# EAGLE design MainBoard (EAGLE 7.6.0)
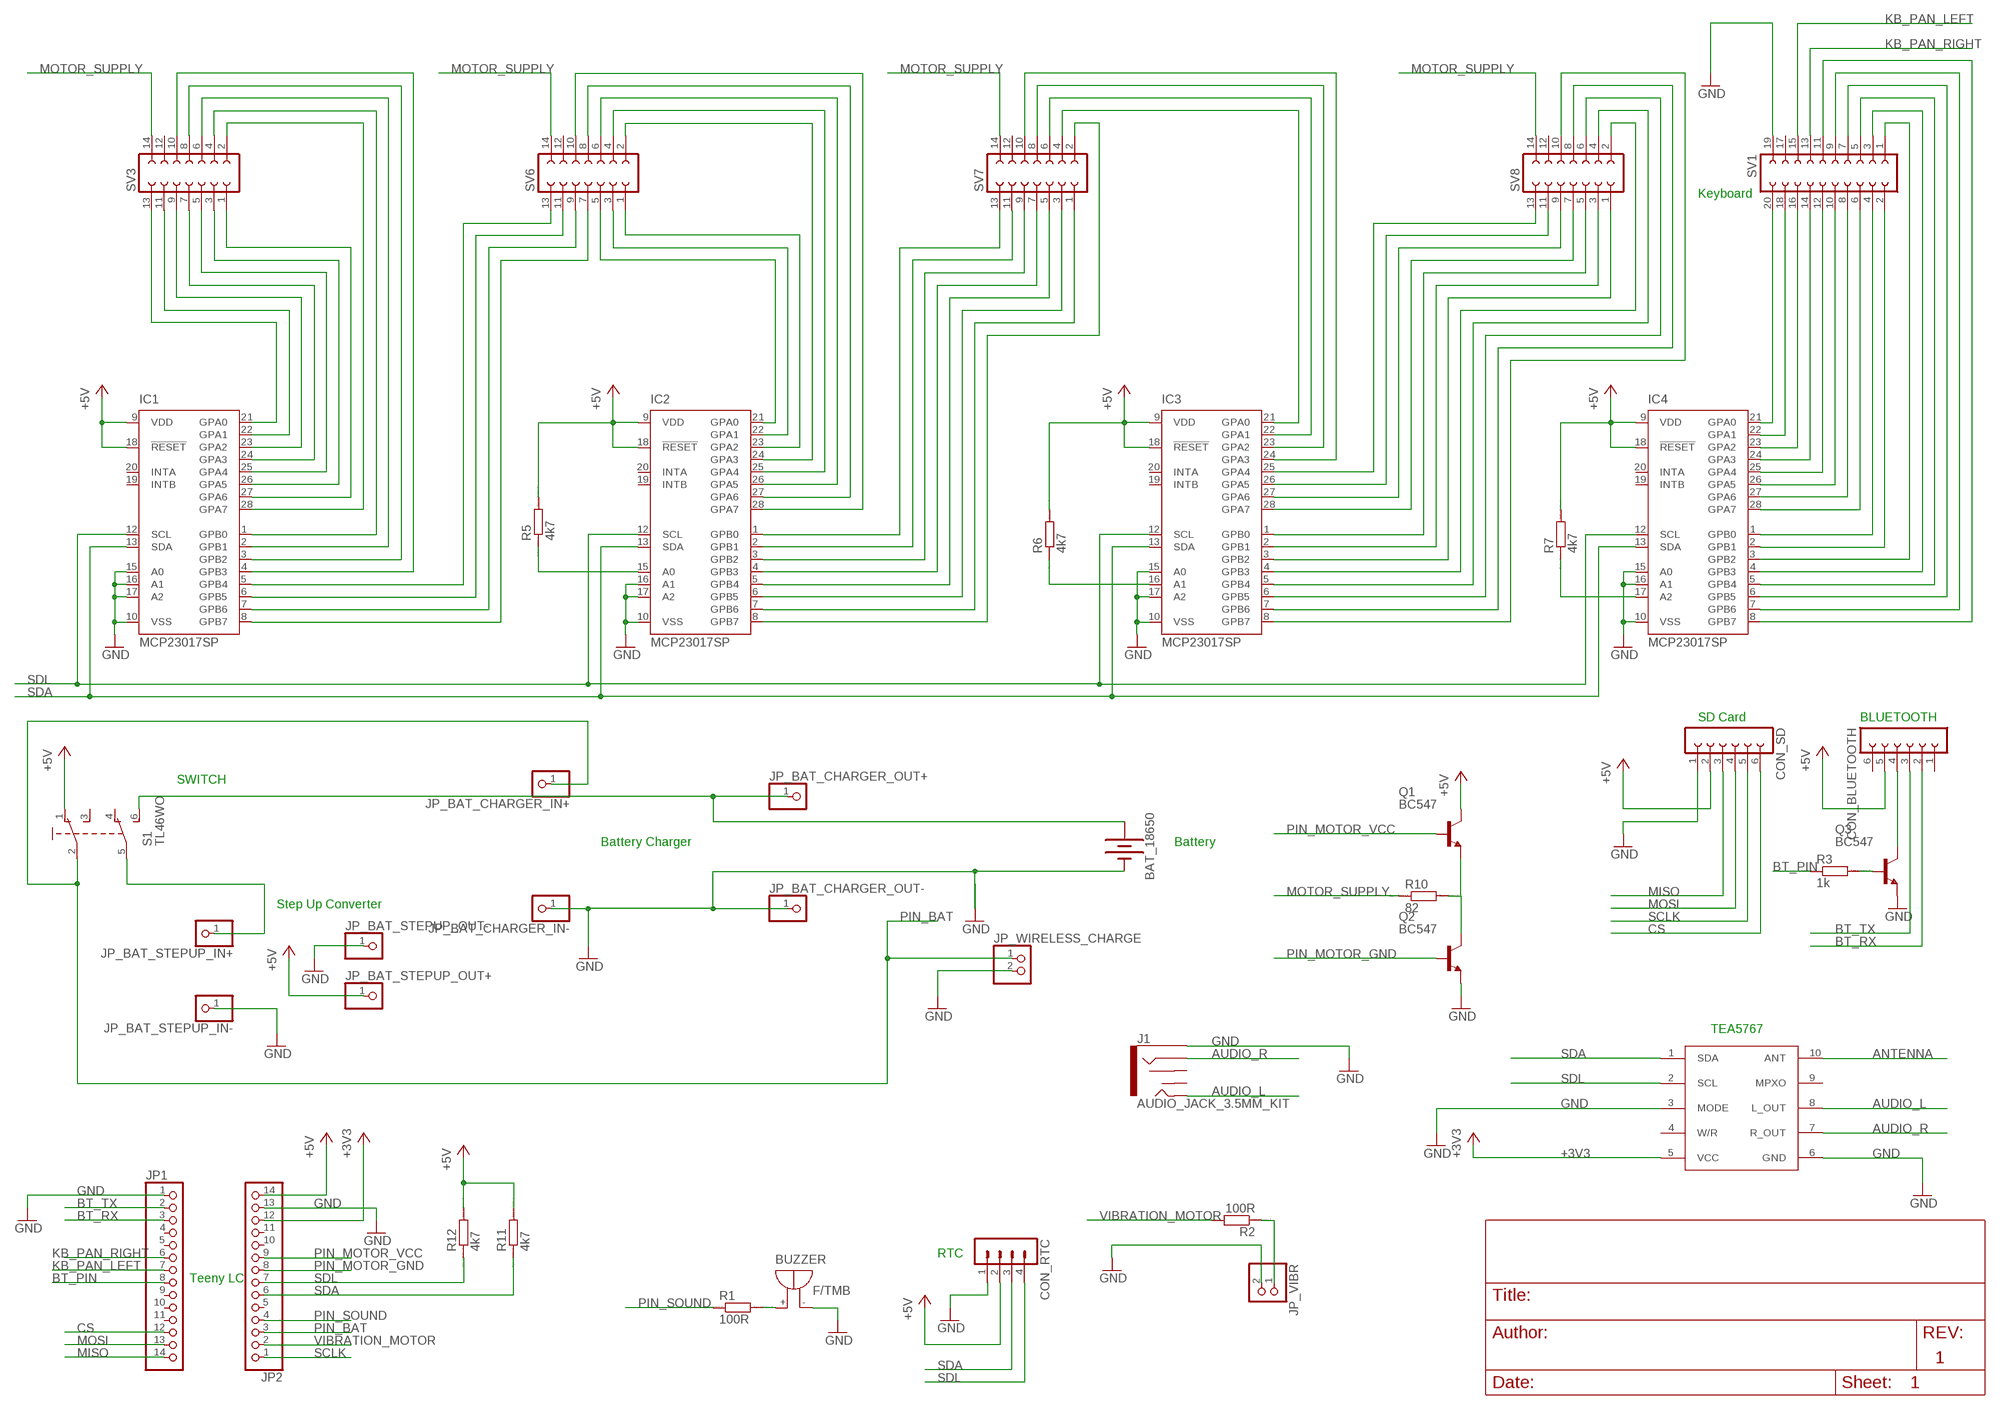
[diagram p0: schematic, sheet 1]
FRAME1 (DINA4_L): AUTHOR: Christoph Ulbinger, BSc; TITLE: Mainboard

## Parts
BAT_18650  BATTERY-18650  [BATTERY_18650-HOLDER]
BUZZER  F/TMB  [F/TMB]
CON_BLUETOOTH  FE06-1  [FE06]
CON_RTC  MA04-1  [MA04-1]
CON_SD  FE06-1  [FE06]
IC1  MCP23017SP  [DIL28-3]
IC2  MCP23017SP  [DIL28-3]
IC3  MCP23017SP  [DIL28-3]
IC4  MCP23017SP  [DIL28-3]
J1  AUDIO_JACK_3.5MM_KIT  [AUDIO-JACK-KIT]
JP1  PINHD-1X14  [1X14]
JP2  PINHD-1X14  [1X14]
JP_BAT_CHARGER_IN+  PINHD-1X1  [1X01]
JP_BAT_CHARGER_IN-  PINHD-1X1  [1X01]
JP_BAT_CHARGER_OUT+  PINHD-1X1  [1X01]
JP_BAT_CHARGER_OUT-  PINHD-1X1  [1X01]
JP_BAT_STEPUP_IN+  PINHD-1X1  [1X01]
JP_BAT_STEPUP_IN-  PINHD-1X1  [1X01]
JP_BAT_STEPUP_OUT+  PINHD-1X1  [1X01]
JP_BAT_STEPUP_OUT-  PINHD-1X1  [1X01]
JP_VIBR  PINHD-1X2  [1X02]
JP_WIRELESS_CHARGE  PINHD-1X2  [1X02]
Q1  BC547  [TO92]
Q2  BC547  [TO92]
Q3  BC547  [TO92]
R1  100R  RR1206  [R1206]
R2  100R  RR1206  [R1206]
R3  1k  RR1206  [R1206]
R5  4k7  RR1206  [R1206]
R6  4k7  RR1206  [R1206]
R7  4k7  RR1206  [R1206]
R10  82  RR1206  [R1206]
R11  4k7  RR1206  [R1206]
R12  4k7  RR1206  [R1206]
S1  TL46WO  [TL4XWO]
SV1  FE10-2  [FE10-2]
SV3  FE07-2  [FE07-2]
SV6  FE07-2  [FE07-2]
SV7  FE07-2  [FE07-2]
SV8  FE07-2  [FE07-2]
TEA5767  TEA5767BREAKOUT  [TEA5767MM2]

## Nets
+3V3: JP2.12 TEA5767.5(VCC)
+5V: CON_BLUETOOTH.5 CON_RTC.2 CON_SD.2 IC1.9(VDD) IC1.18(!RESET) IC2.9(VDD) IC2.18(!RESET) IC3.9(VDD) IC3.18(!RESET) IC4.9(VDD) IC4.18(!RESET) JP2.14 JP_BAT_STEPUP_OUT+.1 Q1.3(C) R5.2 R6.2 R7.2 R11.2 R12.2 S1.1(O)
ANTENNA: TEA5767.10(ANT)
AUDIO_L: J1.TIP TEA5767.8(L_OUT)
AUDIO_R: J1.RING TEA5767.7(R_OUT)
BAT_PLUS: BAT_18650.PWR@1(+) JP_BAT_CHARGER_OUT+.1 S1.6(S1)
BT_PIN: JP1.8 R3.1
BT_RX: CON_BLUETOOTH.2 JP1.3
BT_TX: CON_BLUETOOTH.3 JP1.2
CS: CON_SD.6 JP1.12
GND: BAT_18650.GND@1(-) BUZZER.- CON_RTC.1 CON_SD.1 IC1.10(VSS) IC1.15(A0) IC1.16(A1) IC1.17(A2) IC2.10(VSS) IC2.16(A1) IC2.17(A2) IC3.10(VSS) IC3.15(A0) IC3.17(A2) IC4.10(VSS) IC4.15(A0) IC4.16(A1) J1.SLEEVE JP1.1 JP2.13 JP_BAT_CHARGER_IN-.1 JP_BAT_CHARGER_OUT-.1 JP_BAT_STEPUP_IN-.1 JP_BAT_STEPUP_OUT-.1 JP_VIBR.2 JP_WIRELESS_CHARGE.2 Q2.1(E) Q3.1(E) SV1.19 TEA5767.3(MODE) TEA5767.6(GND)
KB_PAN_LEFT: JP1.7 SV1.15
KB_PAN_RIGHT: JP1.6 SV1.13
MISO: CON_SD.3 JP1.14
MOSI: CON_SD.4 JP1.13
MOTOR_SUPPLY: R10.1 SV3.14 SV6.14 SV7.14 SV8.14
N$1: IC4.25(GPA4) SV1.12
N$2: Q1.1(E) Q2.3(C) R10.2
N$3: IC1.5(GPB4) SV6.13
N$4: IC4.26(GPA5) SV1.10
N$5: IC4.27(GPA6) SV1.8
N$6: IC4.28(GPA7) SV1.6
N$7: IC4.1(GPB0) SV1.4
N$8: IC4.24(GPA3) SV1.14
N$9: IC4.23(GPA2) SV1.16
N$10: IC4.22(GPA1) SV1.18
N$11: IC4.21(GPA0) SV1.20
N$12: IC4.2(GPB1) SV1.2
N$13: IC4.3(GPB2) SV1.1
N$14: IC4.4(GPB3) SV1.3
N$15: IC4.5(GPB4) SV1.5
N$16: IC4.6(GPB5) SV1.7
N$17: IC4.7(GPB6) SV1.9
N$18: IC4.8(GPB7) SV1.11
N$19: IC1.6(GPB5) SV6.11
N$21: IC3.4(GPB3) SV8.2
N$22: CON_BLUETOOTH.4 Q3.3(C)
N$23: IC2.2(GPB1) SV7.11
N$25: Q3.2(B) R3.2
N$28: BUZZER.+ R1.2
N$29: JP_VIBR.1 R2.1
N$30: JP_BAT_STEPUP_IN+.1 S1.5(P1)
N$35: IC1.7(GPB6) SV6.9
N$37: IC1.8(GPB7) SV6.7
N$39: IC3.21(GPA0) SV7.4
N$40: IC2.22(GPA1) SV6.3
N$41: IC2.25(GPA4) SV6.4
N$42: IC2.26(GPA5) SV6.6
N$43: IC2.27(GPA6) SV6.8
N$44: IC2.28(GPA7) SV6.10
N$45: IC2.1(GPB0) SV7.13
N$47: IC2.3(GPB2) SV7.9
N$48: IC2.4(GPB3) SV7.7
N$49: IC2.5(GPB4) SV7.5
N$56: IC1.24(GPA3) SV3.7
N$57: IC1.23(GPA2) SV3.9
N$58: IC1.22(GPA1) SV3.11
N$59: IC1.25(GPA4) SV3.5
N$60: IC1.26(GPA5) SV3.3
N$61: IC1.27(GPA6) SV3.1
N$62: IC1.28(GPA7) SV3.2
N$63: IC1.1(GPB0) SV3.4
N$64: IC1.2(GPB1) SV3.6
N$65: IC1.3(GPB2) SV3.8
N$66: IC1.4(GPB3) SV3.10
N$74: IC4.17(A2) R7.1
N$76: IC3.16(A1) R6.1
N$78: IC2.15(A0) R5.1
N$79: IC3.22(GPA1) SV7.6
N$83: IC2.7(GPB6) SV7.1
N$84: IC1.21(GPA0) SV3.13
N$85: IC2.8(GPB7) SV7.2
N$88: IC2.6(GPB5) SV7.3
N$96: IC2.24(GPA3) SV6.2
N$97: IC2.21(GPA0) SV6.5
N$98: IC2.23(GPA2) SV6.1
N$99: IC3.23(GPA2) SV7.8
N$100: IC3.26(GPA5) SV8.11
N$101: IC3.6(GPB5) SV8.6
N$102: IC3.8(GPB7) SV8.10
N$103: IC3.7(GPB6) SV8.8
N$104: IC3.5(GPB4) SV8.4
N$105: IC3.3(GPB2) SV8.1
N$106: IC3.2(GPB1) SV8.3
N$107: IC3.1(GPB0) SV8.5
N$108: IC3.28(GPA7) SV8.7
N$109: IC3.27(GPA6) SV8.9
N$110: IC3.25(GPA4) SV8.13
N$111: IC3.24(GPA3) SV7.10
PIN_BAT: JP2.3 JP_BAT_CHARGER_IN+.1 JP_WIRELESS_CHARGE.1 S1.2(P)
PIN_MOTOR_GND: JP2.8 Q2.2(B)
PIN_MOTOR_VCC: JP2.9 Q1.2(B)
PIN_SOUND: JP2.4 R1.1
SCLK: CON_SD.5 JP2.1
SDA: CON_RTC.3 IC1.13(SDA) IC2.13(SDA) IC3.13(SDA) IC4.13(SDA) JP2.6 R11.1 TEA5767.1(SDA)
SDL: CON_RTC.4 IC1.12(SCL) IC2.12(SCL) IC3.12(SCL) IC4.12(SCL) JP2.7 R12.1 TEA5767.2(SCL)
VIBRATION_MOTOR: JP2.2 R2.2
Unconnected: CON_BLUETOOTH.1 CON_BLUETOOTH.6 IC1.19(INTB) IC1.20(INTA) IC2.19(INTB) IC2.20(INTA) IC3.19(INTB) IC3.20(INTA) IC4.19(INTB) IC4.20(INTA) J1.RSH J1.TSH JP1.4 JP1.5 JP1.9 JP1.10 JP1.11 JP2.5 JP2.10 JP2.11 S1.3(S) S1.4(O1) SV1.17 SV3.12 SV6.12 SV7.12 SV8.12 TEA5767.4(W/R) TEA5767.9(MPXO)

## Notes on the sheet
- Keyboard
- SD Card | BLUETOOTH
- SWITCH
- Battery Charger | Battery
- Step Up Converter
- TEA5767
- RTC
- Teeny LC

## Library data of the parts
BAT_18650 = SparkFun-Batteries:BATTERY: Battery - Single Cell A variety of battery chemistries, sizes, and footprints. Device List: 20MM_PTH - Coin Cell Battery Holder - 20mm (PTH) <https://www.sparkfun.com/products/783> 12MM_SMD - Coin Cell Battery Holder - 12mm (SMD) <https://www.sparkfun.com/products/10592> 12MM_PTH - Coin Cell Battery Holder - 12mm (PTH) <https://www.sparkfun.com/products/7948> 20MM_SMD - 20mm Coin Cell Battery Holder (SMD) (2 legs) Used on the Big Time Watch Kit <https://www.sparkfun.com/products/11734> 20MM_SMD_4LEGS - Coin Cell Battery Holder - 20mm (SMD) <https://www.sparkfun.com/products/11892> 20MM_SMD_4LEGS_OVERPASTE - Coin Cell Battery Holder - 20mm (SMD) <https://www.sparkfun.com/products/11892> (Over-paste on the legs) 24.5MM_PTH - Coin Cell Battery Holder - 24.5mm (PTH) <https://www.sparkfun.com/products/8863> 9V - 9V Battery Holder - PC Mount Used on the SparkFun SparkPunk Sound Kit <https://www.sparkfun.com/products/11177> and SparkFun SparkPunk Sequencer Kit <https://www.sparkfun.com/products/12707> 18650 - Battery Holder - 18650 (PTH) <https://www.sparkfun.com/products/13113> AA - Battery Holder - 1xAA (PTH) <https://www.sparkfun.com/products/7949> AAA - Battery Holder - 1xAAA (PTH) <https://www.sparkfun.com/products/12718> AA_KIT - Battery Holder - 1xAA (PTH) <https://www.sparkfun.com/products/7949> Special kit package - pads only have exposed copper on one side of the board. AAA_KIT - Battery Holder - 1xAAA (PTH) <https://www.sparkfun.com/products/12718> Special kit package - pads only have exposed copper on one side of the board.; PROD_ID: BATT-12327; SF_SKU: PRT-13113
BUZZER = buzzer:F/TMB: BUZZER Source: Buerklin; OC_FARNELL: unknown; OC_NEWARK: unknown
CON_BLUETOOTH CON_SD = con-lsta:FE06-1: FEMALE HEADER; OC_FARNELL: unknown; OC_NEWARK: unknown
CON_RTC = con-lstb:MA04-1: PIN HEADER; OC_FARNELL: unknown; OC_NEWARK: unknown
IC1-IC4 = microchip:MCP23017: http://ww1.microchip.com/downloads/en/DeviceDoc/21952a.pdf Source: http://ww1.microchip.com/downloads/en/DeviceDoc/21952a.pdf; MF: MICROCHIP; MPN: MCP23017-E/SP; OC_FARNELL: 1332088; OC_NEWARK: 31K2959
J1 = SparkFun-Connectors:AUDIO_JACK_3.5MM: Audio Jack 3.5mm variants of PTH and SMT stereo audio jack with bypass switches. SparkFun Products: SparkFun SparkPunk Sound Kit <[https://www.sparkfun.com/products/11177]> - PTH MP3 Trigger <https://www.sparkfun.com/products/13720> -3.5mm SMD SparkFun PicoBoard <https://www.sparkfun.com/products/11888>- 2.5mm SMD; PROD_ID: CONN-08774; SF_ID: PRT-08032
JP1 JP2 = pinhead:PINHD-1X14: PIN HEADER
JP_BAT_CHARGER_IN+ JP_BAT_CHARGER_IN- JP_BAT_CHARGER_OUT+ JP_BAT_CHARGER_OUT- JP_BAT_STEPUP_IN+ JP_BAT_STEPUP_IN- JP_BAT_STEPUP_OUT+ JP_BAT_STEPUP_OUT- = pinhead:PINHD-1X1: PIN HEADER
JP_VIBR JP_WIRELESS_CHARGE = pinhead:PINHD-1X2: PIN HEADER
Q1-Q3 = transistor-npn:BC547*: NPN Transistor
R1-R3 R5-R7 R10-R12 = eagle-ltspice:R: RESISTOR, European symbol; SPICEMODEL: NONE; SPICEPREFIX: R
S1 = switch:TL46WO: TINY SWITCH ON - ON Source: http://www2.produktinfo.conrad.com/datenblaetter/700000-724999/705152-da-01-de-Subminiaturschalter_TL_36WO.pdf
SV1 = con-lsta:FE10-2: FEMALE HEADER; OC_FARNELL: unknown; OC_NEWARK: unknown
SV3 SV6-SV8 = con-lsta:FE07-2: FEMALE HEADER; OC_FARNELL: unknown; OC_NEWARK: unknown
TEA5767 = MyParts:TEA5767BREAKOUT

## Board
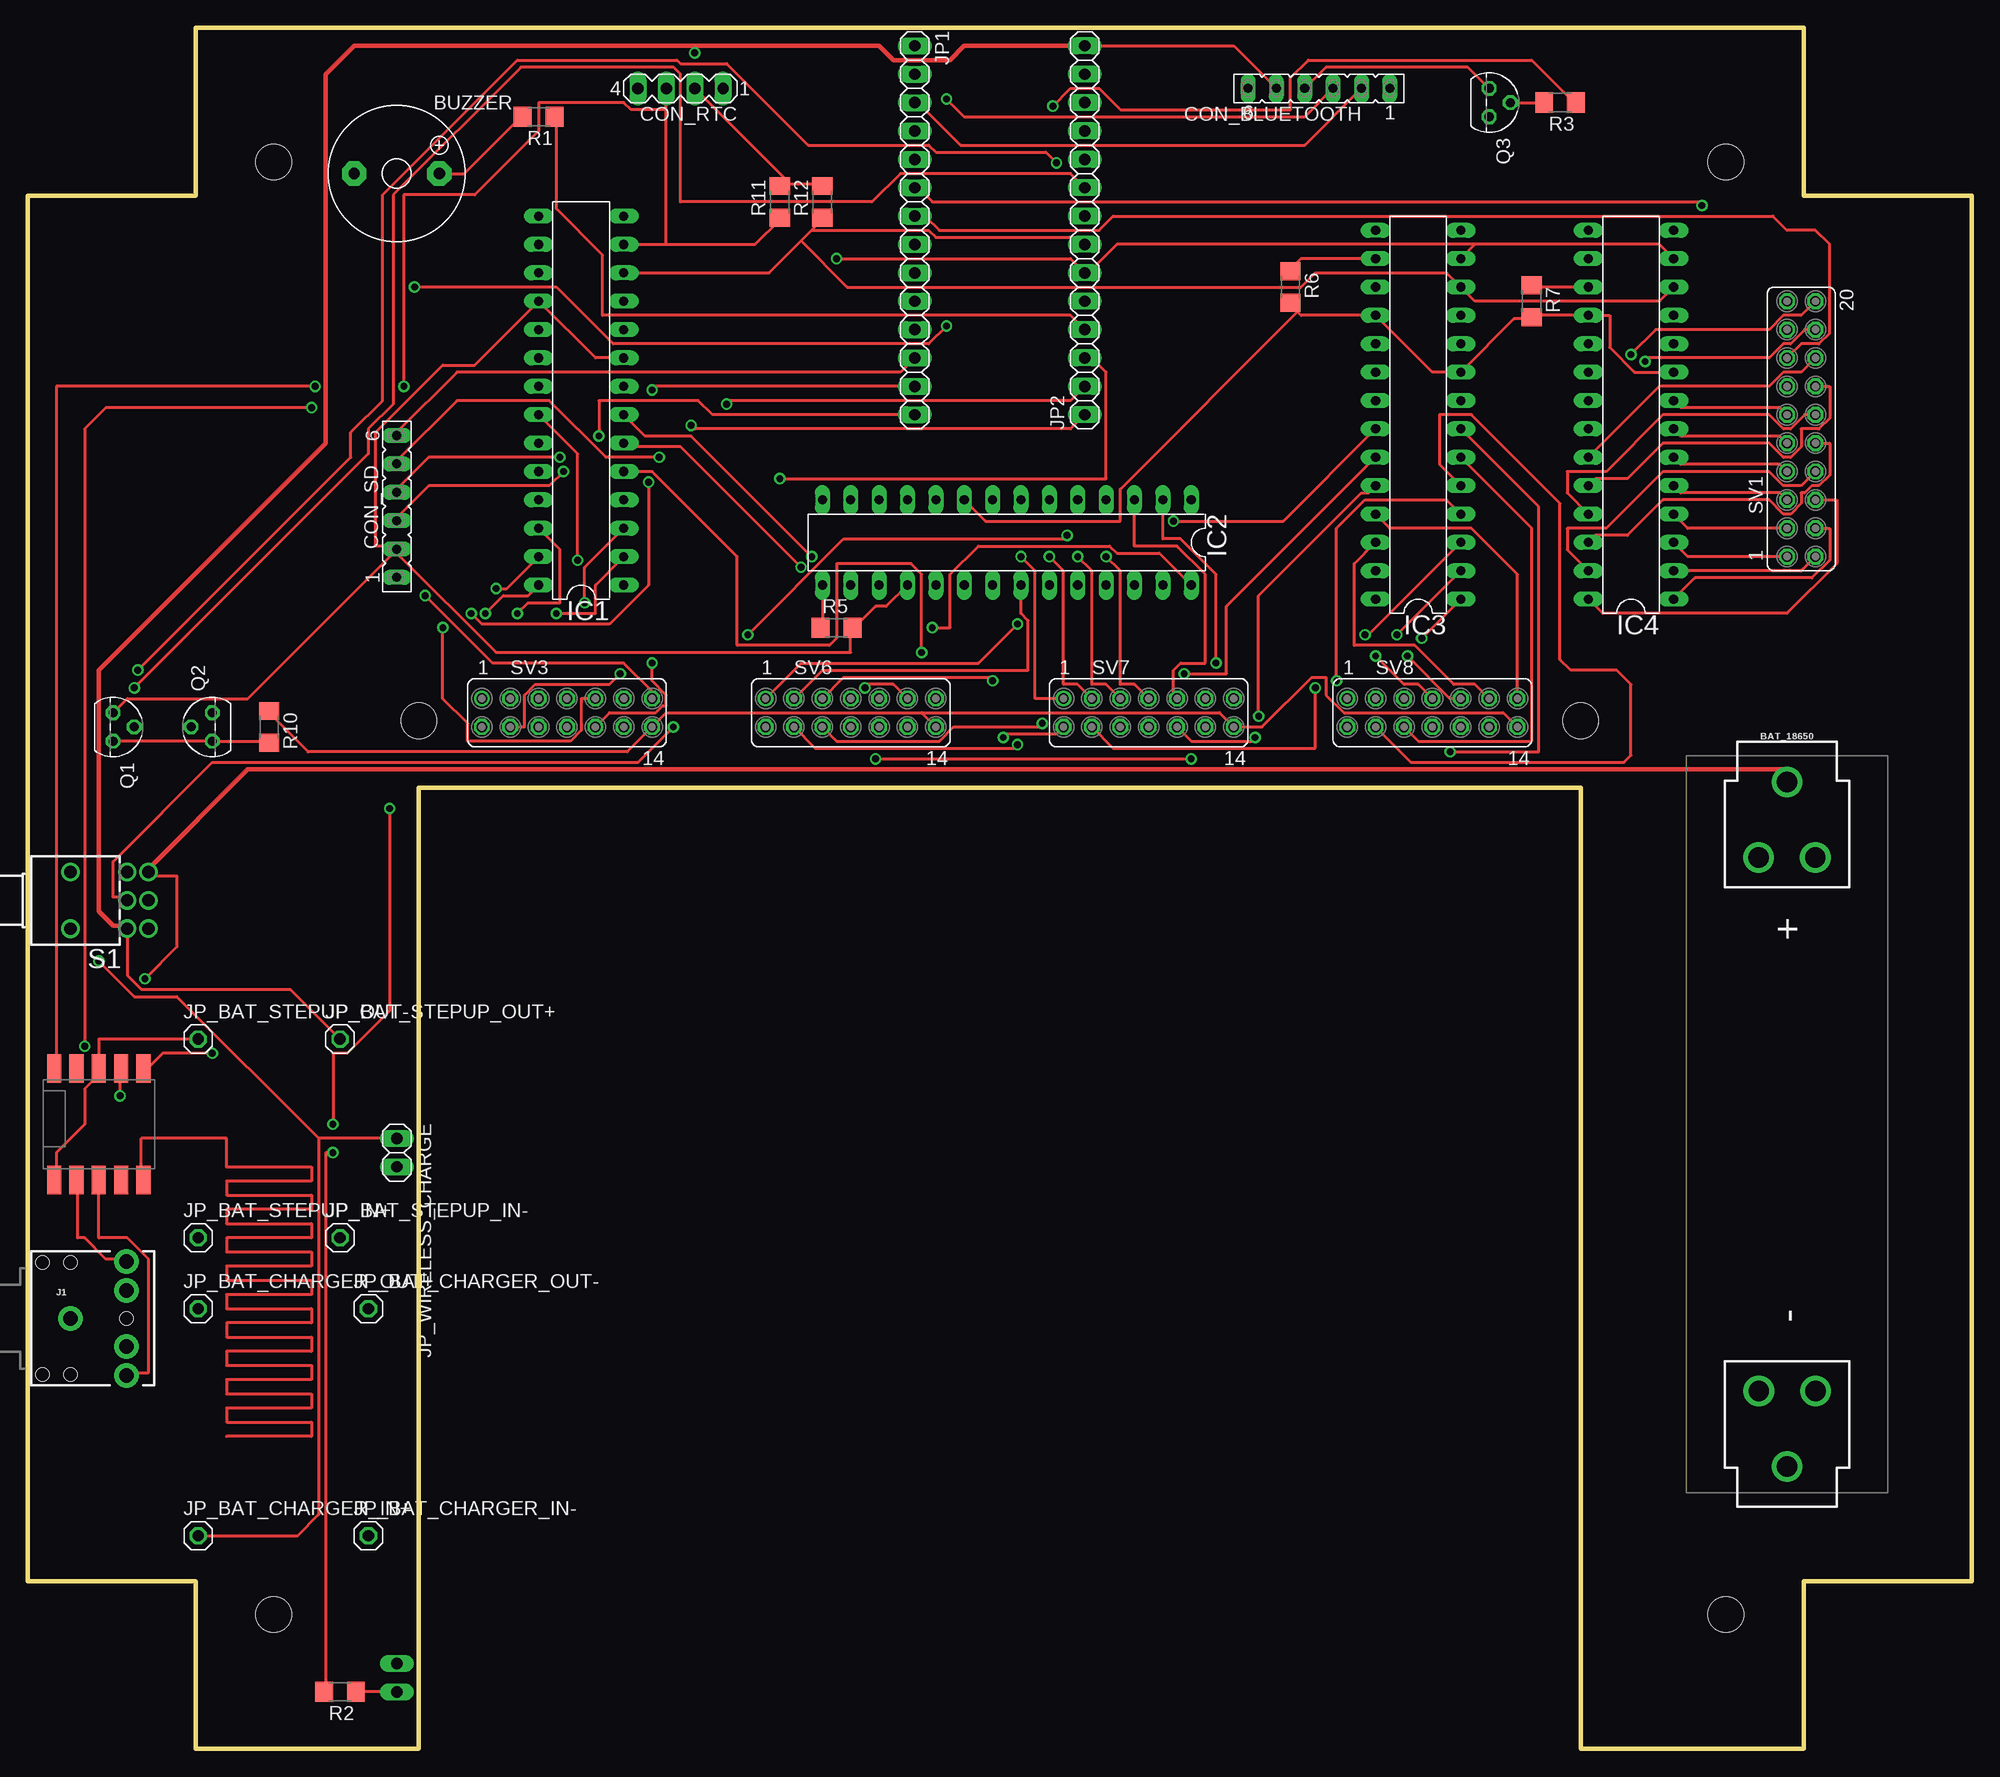
[diagram p1: board, top side]
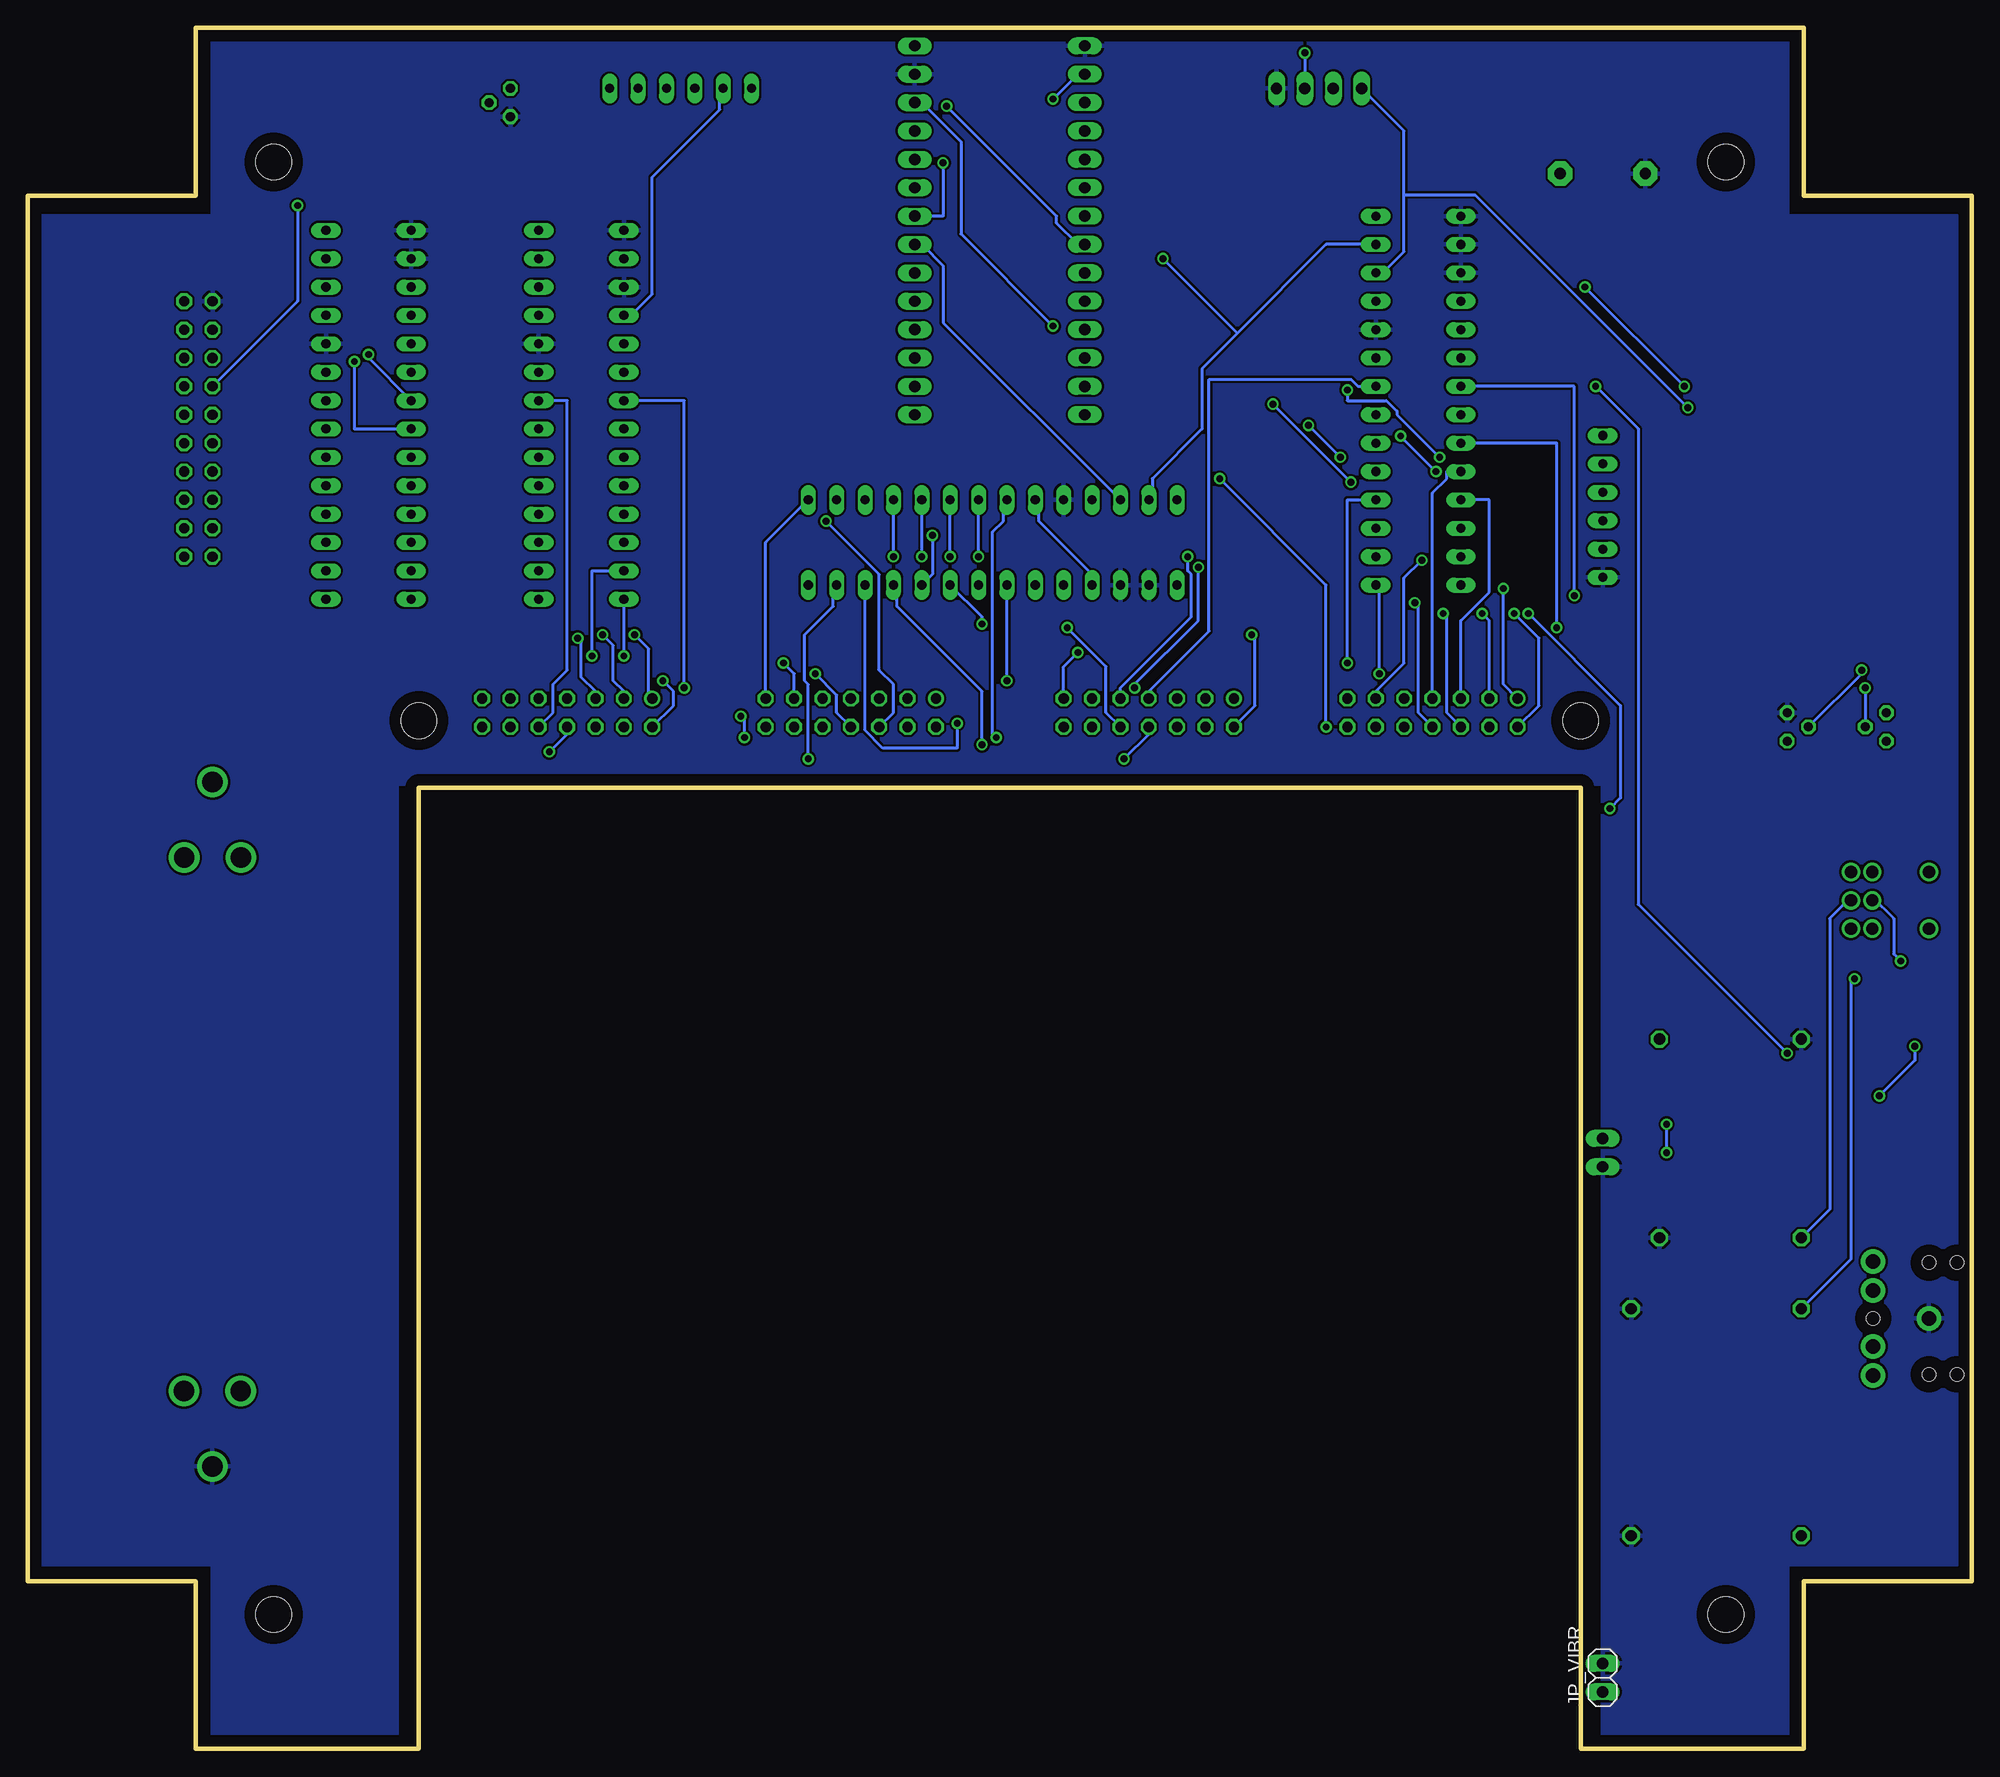
[diagram p2: board, bottom side, seen from below]

Size 174 x 154 mm. Coordinates in mm from the lower left corner, seen from the top.
Outline: 0,15 15,15 15,0 35,0 35,86 139,86 139,0 159,0 159,15 174,15 174,139 159,139 159,154 15,154 15,139 0,139 0,15
Copper layers (1*16): Top 0.035mm / dielectric 1.5mm / Bottom 0.035mm
Design rules "default": minimum track width 10mil, minimum drill 24mil, track to track 8mil, track to pad 8mil, pad to pad 8mil, via to via 8mil, smd to smd 8mil, copper to edge 40mil, drill to drill 8mil, minimum pad ring 10mil, minimum via ring 8mil, stop-mask expansion 4mil, vias tented up to drill 0mil, thermal gap 10mil
Holes 3.2 mm at 22,142 35,92 139,92 152,142 152,12 22,12

### Footprints (pad centres in the part's own frame; a part is rotated, then mirrored left to right if it is on the bottom)
BATTERY_18650-HOLDER = drill 1.829: GND@1 30.628,0.01; GND@2 23.88,2.55; GND@3 23.88,-2.53; PWR@1 -30.628,-0.01; PWR@2 -23.88,2.53; PWR@3 -23.88,-2.55
F/TMB = drill 1.016 pad 2.159 octagon: + 3.81,0; - -3.81,0
FE06 = drill 0.813 long: 1 -6.35,0; 2 -3.81,0; 3 -1.27,0; 4 1.27,0; 5 3.81,0; 6 6.35,0
MA04-1 = drill 1.016 long: 1 -3.81,0; 2 -1.27,0; 3 1.27,0; 4 3.81,0
DIL28-3 = drill 0.813 long: 1 -16.51,-3.81; 2 -13.97,-3.81; 3 -11.43,-3.81; 4 -8.89,-3.81; 5 -6.35,-3.81; 6 -3.81,-3.81; 7 -1.27,-3.81; 8 1.27,-3.81; 9 3.81,-3.81; 10 6.35,-3.81; 11 8.89,-3.81; 12 11.43,-3.81; 13 13.97,-3.81; 14 16.51,-3.81; 15 16.51,3.81; 16 13.97,3.81; 17 11.43,3.81; 18 8.89,3.81; 19 6.35,3.81; 20 3.81,3.81; 21 1.27,3.81; 22 -1.27,3.81; 23 -3.81,3.81; 24 -6.35,3.81; 25 -8.89,3.81; 26 -11.43,3.81; 27 -13.97,3.81; 28 -16.51,3.81
AUDIO-JACK-KIT = drill 1.3 pad 2.184: RING 5,5.1; RSH 5,2.5; SLEEVE 0,0; TIP 5,-5.1; TSH 5,-2.5 | hole 1.2: 0,5; -2.5,5; -2.5,-5; 0,-5; 5,0
1X14 = drill 1.016 long: 1 -16.51,0; 2 -13.97,0; 3 -11.43,0; 4 -8.89,0; 5 -6.35,0; 6 -3.81,0; 7 -1.27,0; 8 1.27,0; 9 3.81,0; 10 6.35,0; 11 8.89,0; 12 11.43,0; 13 13.97,0; 14 16.51,0
1X01 = drill 1.016 octagon: 1 0,0
1X02 = drill 1.016 long: 1 -1.27,0; 2 1.27,0
TO92 = drill 0.813 octagon: 1 1.27,0; 2 0,1.905; 3 -1.27,0
R1206 = smd 1.6 x 1.803: 1 -1.422,0; 2 1.422,0
TL4XWO = drill 1.1 pad 1.422: 1 -2.54,-5.08; 2 0,-5.08; 3 2.54,-5.08; 4 -2.54,-6.985; 5 0,-6.985; 6 2.54,-6.985 | drill 1.1 pad 1.676: M1 -2.54,0; M2 2.54,0
FE10-2 = drill 0.914 octagon: 1 -11.43,1.27; 2 -11.43,-1.27; 3 -8.89,1.27; 4 -8.89,-1.27; 5 -6.35,1.27; 6 -6.35,-1.27; 7 -3.81,1.27; 8 -3.81,-1.27; 9 -1.27,1.27; 10 -1.27,-1.27; 11 1.27,1.27; 12 1.27,-1.27; 13 3.81,1.27; 14 3.81,-1.27; 15 6.35,1.27; 16 6.35,-1.27; 17 8.89,1.27; 18 8.89,-1.27; 19 11.43,1.27; 20 11.43,-1.27
FE07-2 = drill 0.914: 1 -7.62,1.27 | drill 0.914 octagon: 2 -7.62,-1.27; 3 -5.08,1.27; 4 -5.08,-1.27; 5 -2.54,1.27; 6 -2.54,-1.27; 7 0,1.27; 8 0,-1.27; 9 2.54,1.27; 10 2.54,-1.27; 11 5.08,1.27; 12 5.08,-1.27; 13 7.62,1.27; 14 7.62,-1.27
TEA5767MM2 = smd 2.54 x 1.27: 1 -5,4; 2 -5,2; 3 -5,0; 4 -5,-2; 5 -5,-4; 6 5,-4; 7 5,-2; 8 5,0; 9 5,2; 10 5,4

### Placement (x,y rotation side)
BAT_18650  157.48,55.88 270 top
BUZZER  33.02,140.97 0 top
CON_BLUETOOTH  115.57,148.59 180 top
CON_RTC  58.42,148.59 180 top
CON_SD  33.02,111.17 90 top
IC1  49.53,120.65 90 top
IC2  87.63,107.95 180 top
IC3  124.46,119.38 90 top
IC4  143.51,119.38 90 top
J1  3.81,38.5 0 top
JP1  79.38,135.89 270 top
JP2  94.62,135.89 90 top
JP_BAT_CHARGER_IN+  15.24,19.05 0 top
JP_BAT_CHARGER_IN-  30.48,19.05 0 top
JP_BAT_CHARGER_OUT+  15.24,39.37 0 top
JP_BAT_CHARGER_OUT-  30.48,39.37 0 top
JP_BAT_STEPUP_IN+  15.24,45.72 0 top
JP_BAT_STEPUP_IN-  27.94,45.72 0 top
JP_BAT_STEPUP_OUT+  27.94,63.5 0 top
JP_BAT_STEPUP_OUT-  15.24,63.5 0 top
JP_VIBR  33.02,6.35 90 bottom
JP_WIRELESS_CHARGE  33.02,53.34 270 top
Q1  7.62,91.44 270 top
Q2  16.51,91.44 90 top
Q3  130.81,147.32 270 top
R1  45.72,146.05 180 top
R2  27.94,5.08 180 top
R3  137.16,147.32 180 top
R5  72.39,100.33 0 top
R6  113.03,130.81 270 top
R7  134.62,129.54 270 top
R10  21.59,91.44 270 top
R11  67.31,138.43 90 top
R12  71.12,138.43 90 top
S1  3.81,75.92 90 top
SV1  158.75,118.11 90 top
SV3  48.26,92.71 0 top
SV6  73.66,92.71 0 top
SV7  100.33,92.71 0 top
SV8  125.73,92.71 0 top
TEA5767  6.35,55.88 270 top

### Tracks (layer width: path | path; a pad name or v marks a point on that pad's centre or on a via)
+3V3  (via drill 0.61)
  Top 0.254: v25.72,121.92 2.54,121.92 2.54,60.96 TEA5767.5 | v34.61,130.81 47.31,130.81 52.39,125.73 80.64,125.73 v82.23,127.32
  Bottom 0.254: v34.61,130.81 v25.72,121.92 | v82.23,127.32 90.49,135.57 90.49,143.83 93.98,147.32 JP2.12
+5V  (via drill 0.61)
  Top 0.254: 68.26,140.02 71.12,140.02 R12.2 | 68.26,140.02 67.31,140.02 R11.2 | 68.26,140.02 CON_RTC.2 | CON_BLUETOOTH.5 107.95,152.4 JP2.14 | 113.67,128.59 113.98,128.27 IC3.18 125.73,123.19 IC3.9 133.03,127.95 134.62,127.95 R7.2 134.62,128.27 IC4.18 141.6,128.27 141.6,125.41 143.83,123.19 IC4.9 | 113.67,128.59 113.03,129.22 R6.2 | IC2.18 76.83,102.23 75.88,102.23 73.98,100.33 R5.2 73.66,100.33 73.66,98.11 41.91,98.11 33.02,107 32.7,107 | IC1.9 50.8,124.46 IC1.18 40.01,123.83 37.15,123.83 31.11,117.79 31.11,107.63 33.02,107.63 CON_SD.2 | 8.89,73.66 S1.1 | 32.7,107 19.68,93.98 8.89,93.98 Q1.3 | 32.7,107 33.02,107.31 CON_SD.2 | 8.89,73.34 S1.1 | 32.7,107 CON_SD.2 | 113.67,128.59 97.79,112.71 97.79,109.86 85.72,109.86 IC2.9 | 59.69,152.4 v59.69,151.76 | JP_BAT_STEPUP_OUT+.1 23.5,67.94 10.16,67.94 8.89,69.22 S1.1
  Top 0.406: 8.89,73.66 7.62,73.66 6.35,74.93 6.35,96.52 26.67,116.84 26.67,149.86 29.21,152.4 59.69,152.4 76.2,152.4 77.47,151.13 82.55,151.13 83.82,152.4 JP2.14
  Bottom 0.254: IC2.9 83.5,111.44 83.5,109.86 78.74,105.09 IC2.18 | CON_BLUETOOTH.5 112.08,148.27 112.08,146.69 118.11,140.65 118.11,130.18 120.02,128.27 IC3.18 | v59.69,151.76 CON_RTC.2
AUDIO_L
  Top 0.254: TEA5767.8 6.35,45.72 8.89,45.72 10.79,43.81 10.79,33.66 8.89,33.66 J1.TIP
AUDIO_R
  Top 0.254: TEA5767.7 4.45,50.8 4.45,45.72 5.08,45.72 6.99,43.81 8.26,43.81 J1.RING
BAT_PLUS  (via drill 0.61)
  Top 0.254: 10.79,78.74 S1.6 10.79,78.11 13.34,78.11 13.34,71.75 v10.48,68.9
  Top 0.406: 10.79,78.74 19.68,87.63 157.48,87.63 BAT_18650.PWR@1
  Bottom 0.254: 10.79,78.42 S1.6 | JP_BAT_CHARGER_OUT+.1 10.79,43.81 10.79,68.58 v10.48,68.9
BT_PIN  (via drill 0.61)
  Top 0.254: v91.76,147 93.34,148.59 95.89,148.59 97.79,146.69 113.03,146.69 113.03,149.54 114.62,151.13 134.62,151.13 138.43,147.32 R3.1
  Bottom 0.254: v91.76,147 81.92,137.16 81.92,136.53 80.01,134.62 JP1.8
BT_RX
  Top 0.254: CON_BLUETOOTH.2 114.3,143.51 83.5,143.51 79.69,147.32 JP1.3
BT_TX  (via drill 0.61)
  Top 0.254: CON_BLUETOOTH.3 114.3,146.05 83.82,146.05 v82.23,147.64
  Bottom 0.254: v82.23,147.64 80.01,149.86 JP1.2
CS
  Top 0.254: CON_SD.6 33.02,117.79 38.42,123.19 78.11,123.19 JP1.12
GND
  Top 0.254: 2.54,51.44 TEA5767.6 2.54,51.07 2.54,53.34 5.08,55.88 5.08,59.05 6.35,60.33 TEA5767.3 6.35,63.5 JP_BAT_STEPUP_OUT-.1
  pour Bottom: 1.27,16.51 1.27,137.16 16.51,137.16 16.51,153.67 157.48,153.67 157.48,137.16 172.72,137.16 172.72,16.51 157.48,16.51 157.48,1.27 140.97,1.27 140.97,86.36 33.02,86.36 33.02,1.27 16.51,1.27 16.51,16.51
KB_PAN_LEFT
  Top 0.254: SV1.15 158.75,125.73 160.34,125.73 161.29,126.68 161.29,134.62 160.02,135.89 157.48,135.89 156.21,137.16 97.16,137.16 95.89,135.89 81.6,135.89 80.33,137.16 JP1.7
KB_PAN_RIGHT  (via drill 0.61)
  Top 0.254: v149.86,138.11 149.54,138.43 80.96,138.43 79.69,139.7 JP1.6
  Bottom 0.254: SV1.13 149.86,129.54 v149.86,138.11
MISO  (via drill 0.61)
  Top 0.254: v47.94,114.3 46.67,113.03 35.88,113.03 33.02,110.17 CON_SD.3 | v51.12,117.47 51.12,120.65 60.01,120.65 61.28,119.38 JP1.14
  Bottom 0.254: v51.12,117.47 v47.94,114.3
MOSI  (via drill 0.61)
  Top 0.254: v47.62,115.57 35.88,115.57 33.02,112.71 CON_SD.4 | v55.88,121.6 56.2,121.92 JP1.13
  Bottom 0.254: v47.62,115.57 51.44,119.38 51.44,119.7 52.39,120.65 55.88,120.65 v55.88,121.6
MOTOR_SUPPLY
  Top 0.254: R10.1 21.59,92.71 25.08,89.22 53.66,89.22 SV3.14 57.15,92.71 80.01,92.71 | 80.01,92.71 SV6.14 | 80.01,92.71 106.68,92.71 SV7.14 110.49,91.44 114.94,95.89 116.2,95.89 116.2,94.3 117.79,92.71 132.08,92.71 SV8.14
N$1
  Top 0.254: IC4.25 137.79,112.39 137.79,114.3 141.29,114.3 146.37,119.38 155.89,119.38 157.16,118.11 157.8,118.11 159.07,119.38 SV1.12
N$2
  Top 0.254: R10.2 21.59,90.17 Q2.3 Q1.1
N$3  (via drill 0.61)
  Top 0.254: IC1.5 55.88,114.3 63.5,106.68 63.5,98.74 71.75,98.74 72.39,99.38 72.39,106.05 79.06,106.05 80.01,105.09 v80.01,98.11
  Bottom 0.254: v80.01,98.11 81.28,96.84 SV6.13
N$4
  Top 0.254: IC4.26 140.34,108.58 143.19,108.58 146.37,111.76 155.89,111.76 157.16,110.49 157.8,110.49 158.75,111.44 158.75,112.39 159.07,112.39 159.7,113.03 160.34,113.03 161.29,113.98 161.29,116.84 SV1.10
N$5
  Top 0.254: IC4.27 137.79,107.31 137.79,109.22 141.29,109.22 146.37,114.3 155.89,114.3 157.16,113.03 158.75,113.03 SV1.8
N$6
  Top 0.254: IC4.28 140.97,101.6 157.48,101.6 161.93,106.05 161.93,111.76 SV1.6
N$7
  Top 0.254: IC4.1 149.22,104.78 159.7,104.78 161.29,106.36 161.29,109.22 SV1.4
N$8
  Top 0.254: IC4.24 140.34,113.67 143.19,113.67 146.37,116.84 155.89,116.84 157.16,115.57 157.8,115.57 158.75,116.52 158.75,118.11 160.34,118.11 161.29,119.06 161.29,121.92 SV1.14
N$9
  Top 0.254: IC4.23 146.05,121.92 155.89,121.92 157.16,123.19 158.75,123.19 SV1.16
N$10  (via drill 0.61)
  Top 0.254: v144.78,124.14 145.1,124.46 155.89,124.46 157.16,125.73 157.8,125.73 159.07,127 SV1.18
  Bottom 0.254: IC4.22 144.78,118.11 v144.78,124.14
N$11  (via drill 0.61)
  Top 0.254: v143.51,124.78 145.73,127 155.89,127 157.16,128.27 158.75,128.27 SV1.20
  Bottom 0.254: IC4.21 143.51,124.46 v143.51,124.78
N$12
  Top 0.254: IC4.2 158.75,105.41 SV1.2
N$13
  Top 0.254: IC4.3 148.59,106.68 SV1.1
N$14
  Top 0.254: IC4.4 148.59,109.22 SV1.3
N$15
  Top 0.254: IC4.5 147.96,112.39 156.84,112.39 SV1.5
N$16
  Top 0.254: IC4.6 147.96,114.94 156.84,114.94 SV1.7
N$17
  Top 0.254: IC4.7 147.96,117.47 156.84,117.47 SV1.9
N$18
  Top 0.254: IC4.8 147.96,120.02 156.84,120.02 SV1.11
N$19  (via drill 0.61)
  Top 0.254: IC1.6 53.66,116.52 58.42,116.52 v69.22,105.73 | v74.93,94.93 75.25,95.25 77.47,95.25 SV6.11
  Bottom 0.254: v69.22,105.73 69.22,100.97 74.93,95.25 v74.93,94.93
N$20
  Top 0.254: 10.16,50.8 10.16,54.61 17.78,54.61 17.78,52.07 25.4,52.07 25.4,50.8 17.78,50.8 17.78,49.53 25.4,49.53 25.4,48.26 17.78,48.26 17.78,46.99 25.4,46.99 25.4,45.72 17.78,45.72 17.78,44.45 25.4,44.45 25.4,43.18 17.78,43.18 17.78,41.91 25.4,41.91 25.4,40.64 17.78,40.64 17.78,39.37 25.4,39.37 25.4,38.1 17.78,38.1 17.78,36.83 25.4,36.83 25.4,35.56 17.78,35.56 17.78,34.29 25.4,34.29 25.4,33.02 17.78,33.02 17.78,31.75 25.4,31.75 25.4,30.48 17.78,30.48 17.78,29.21 25.4,29.21 25.4,27.94 17.78,27.94
N$21  (via drill 0.61)
  Top 0.254: IC3.4 127,111.76 119.7,111.76 117.16,109.22 v117.16,95.57
  Bottom 0.254: v117.16,95.57 116.2,94.61 116.2,93.34 SV8.2
N$22
  Top 0.254: CON_BLUETOOTH.4 116.2,150.5 128.91,150.5 Q3.3
N$23  (via drill 0.61)
  Top 0.254: IC2.2 101.6,108.27 103.19,108.27 106.36,105.09 v106.36,97.16
  Bottom 0.254: v106.36,97.16 105.41,96.2 SV7.11
N$25
  Top 0.254: Q3.2 R3.2
N$28
  Top 0.254: BUZZER.+ 39.05,140.97 44.13,146.05 R1.2
N$29
  Top 0.254: JP_VIBR.1 R2.1
N$30
  Bottom 0.254: JP_BAT_STEPUP_IN+.1 12.7,48.26 12.7,74.3 10.79,76.2 S1.5
N$35  (via drill 0.61)
  Top 0.254: IC1.7 55.24,117.47 59.37,117.47 v70.17,106.68
  Bottom 0.254: v70.17,106.68 70.17,105.41 69.85,105.09 69.85,101.28 76.2,94.93 SV6.9
N$37
  Bottom 0.254: IC1.8 54.93,121.92 55.56,122.56 68.26,122.56 68.26,100.01 73.66,94.61 SV6.7
N$39  (via drill 0.61)
  Top 0.254: v115.25,94.93 115.25,89.53 97.16,89.53 SV7.4
  Bottom 0.254: IC3.21 115.25,120.65 v115.25,94.93
N$40
  Top 0.254: IC2.22 88.9,101.6 89.53,100.97 89.53,96.52 71.12,96.52 SV6.3
N$41  (via drill 0.61)
  Top 0.254: v88.58,89.85 88.27,89.53 70.48,89.53 SV6.4
  Bottom 0.254: IC2.25 96.2,103.82 96.2,102.23 88.58,94.61 v88.58,89.85
N$42  (via drill 0.61)
  Top 0.254: v90.81,91.76 90.49,91.44 82.87,91.44 81.6,90.17 72.39,90.17 SV6.6
  Bottom 0.254: IC2.26 99.06,91.12 97.47,89.53 90.81,89.53 v90.81,91.76
N$43  (via drill 0.61)
  Top 0.254: v75.88,88.58 v104.14,88.58
  Bottom 0.254: IC2.27 101.92,103.82 101.92,102.23 104.46,99.69 104.46,95.57 104.14,95.25 v104.14,88.58 | v75.88,88.58 73.66,90.81 SV6.8
N$44  (via drill 0.61)
  Top 0.254: IC2.28 101.28,107 97.47,107 96.84,107.63 85.09,107.63 82.55,105.09 82.55,100.33 v80.96,100.33
  Bottom 0.254: v80.96,100.33 77.47,96.84 77.47,92.71 SV6.10
N$45
  Bottom 0.254: IC2.1 107.95,107.95 SV7.13
N$47
  Top 0.254: IC2.3 99.06,107.63 102.87,107.63 105.41,105.09 105.41,97.16 103.19,97.16 102.55,96.52 102.55,93.98 SV7.9
N$48  (via drill 0.61)
  Top 0.254: v96.52,106.68 97.79,105.41 97.79,95.25 99.06,95.25 SV7.7
  Bottom 0.254: v96.52,106.68 IC2.4
N$49  (via drill 0.61)
  Top 0.254: v93.98,106.68 95.25,105.41 95.25,95.25 96.52,95.25 SV7.5
  Bottom 0.254: v93.98,106.68 IC2.5
N$56
  Bottom 0.254: IC1.24 46.99,114.3 46.99,113.67 48.26,112.39 SV3.7
N$57  (via drill 0.61)
  Top 0.254: v37.15,100.33 37.15,93.98 39.37,91.76 39.37,90.17 48.58,90.17 49.53,91.12 49.53,93.98 SV3.9
  Bottom 0.254: IC1.23 37.15,116.84 v37.15,100.33
N$58  (via drill 0.61)
  Top 0.254: IC1.22 49.21,115.89 v49.21,106.36
  Bottom 0.254: v49.21,106.36 50.8,104.78 50.8,97.16 53.34,94.61 SV3.11
N$59
  Bottom 0.254: IC1.25 43.18,111.76 43.18,103.5 45.72,100.97 SV3.5
N$60  (via drill 0.61)
  Top 0.254: IC1.26 47.62,107.31 47.62,102.55 44.77,102.55 v43.81,101.6
  Bottom 0.254: v43.81,101.6 43.18,100.97 SV3.3
N$61  (via drill 0.61)
  Top 0.254: IC1.27 42.86,103.82 v41.91,103.82
  Bottom 0.254: v41.91,103.82 41.91,95.25 SV3.1
N$62  (via drill 0.61)
  Top 0.254: IC1.28 44.77,103.19 42.55,103.19 v40.96,101.6
  Bottom 0.254: v40.96,101.6 38.73,99.38 38.73,93.34 SV3.2
N$63  (via drill 0.61)
  Top 0.254: v53.02,96.2 52.07,95.25 45.4,95.25 44.45,94.3 44.45,91.44 SV3.4
  Bottom 0.254: IC1.1 53.02,103.82 v53.02,96.2
N$64  (via drill 0.61)
  Top 0.254: IC1.2 50.8,104.14 50.8,101.6 v47.31,101.6
  Bottom 0.254: v47.31,101.6 46.99,101.28 46.99,92.71 SV3.6
N$65  (via drill 0.61)
  Top 0.254: IC1.3 49.85,105.73 v49.85,102.55
  Bottom 0.254: v49.85,102.55 49.53,102.23 49.53,92.71 SV3.8
N$66  (via drill 0.61)
  Top 0.254: v55.88,97.16 55.88,95.57 57.15,94.3 57.15,93.34 56.83,93.34 56.2,92.71 52.07,92.71 SV3.10
  Bottom 0.254: IC1.4 55.88,111.76 v55.88,97.16
N$74
  Top 0.254: IC4.17 134.62,130.81 R7.1
N$76
  Top 0.254: IC3.16 113.98,133.35 113.03,132.4 R6.1
N$78
  Top 0.254: IC2.15 71.12,100.33 R5.1
N$79  (via drill 0.61)
  Top 0.254: IC3.22 112.39,109.86 v102.55,109.86
  Bottom 0.254: v102.55,109.86 97.79,105.09 97.79,96.52 96.52,95.25 96.52,92.71 SV7.6
N$83  (via drill 0.61)
  Top 0.254: v88.9,106.68 90.17,105.41 90.17,93.98 SV7.1
  Bottom 0.254: v88.9,106.68 IC2.7
N$84  (via drill 0.61)
  Top 0.254: v35.56,103.19 41.59,97.16 53.34,97.16 55.88,94.61 SV3.13
  Bottom 0.254: IC1.21 35.56,121.92 v35.56,103.19
N$85  (via drill 0.61)
  Top 0.254: v87.31,90.49 87.63,90.81 92.08,90.81 SV7.2
  Bottom 0.254: IC2.8 86.68,111.44 86.68,109.86 87.63,108.9 87.63,90.81 v87.31,90.49
N$88  (via drill 0.61)
  Top 0.254: v91.44,106.68 92.71,105.41 92.71,95.25 93.98,95.25 SV7.3
  Bottom 0.254: v91.44,106.68 IC2.6
N$96  (via drill 0.61)
  Top 0.254: v93.03,108.58 92.71,108.27 73.03,108.27 v64.45,99.69
  Bottom 0.254: IC2.24 93.03,105.09 v93.03,108.58 | v64.45,99.69 64.14,99.38 64.14,93.34 SV6.2
N$97  (via drill 0.61)
  Top 0.254: v86.36,95.57 86.04,95.89 73.03,95.89 SV6.5
  Bottom 0.254: v86.36,95.57 IC2.21
N$98  (via drill 0.61)
  Top 0.254: v88.58,100.65 85.09,97.16 69.22,97.16 SV6.1
  Bottom 0.254: IC2.23 88.58,101.28 v88.58,100.65
N$99  (via drill 0.61)
  Top 0.254: IC3.23 107.31,102.23 107.31,96.2 v103.5,96.2
  Bottom 0.254: v103.5,96.2 101.6,94.3 101.6,92.71 SV7.8
N$100
  Top 0.254: IC3.26 118.75,106.05 118.75,98.74 124.14,98.74 127.64,95.25 129.54,95.25 SV8.11
N$101
  Top 0.254: IC3.6 134.62,109.22 134.62,90.17 124.46,90.17 SV8.6
N$102
  Bottom 0.254: IC3.8 125.73,120.65 125.73,96.52 127,95.25 127,92.71 SV8.10
N$103  (via drill 0.61)
  Top 0.254: IC3.7 135.25,111.12 135.25,89.22 v127.32,89.22
  Bottom 0.254: v127.32,89.22 125.73,90.81 SV8.8
N$104
  Top 0.254: IC3.5 126.36,114.94 126.36,119.38 129.22,119.38 137.16,111.44 137.16,97.47 138.11,96.52 142.24,96.52 143.51,95.25 143.51,88.9 142.88,88.27 123.83,88.27 SV8.4
N$105  (via drill 0.61)
  Top 0.254: IC3.3 120.02,99.69 v119.7,99.69
  Bottom 0.254: v119.7,99.69 118.43,98.42 118.43,94.3 SV8.1
N$106  (via drill 0.61)
  Top 0.254: v122.56,99.69 IC3.2
  Bottom 0.254: v122.56,99.69 121.6,98.74 121.6,95.57 120.65,94.61 SV8.3
N$107  (via drill 0.61)
  Top 0.254: v124.78,99.38 IC3.1
  Bottom 0.254: v124.78,99.38 124.46,99.06 124.46,95.89 123.19,94.61 SV8.5
N$108  (via drill 0.61)
  Top 0.254: v120.65,97.79 123.19,95.25 124.46,95.25 SV8.7
  Bottom 0.254: v120.65,97.79 IC3.28
N$109  (via drill 0.61)
  Top 0.254: v123.51,97.79 127.32,93.98 SV8.9
  Bottom 0.254: IC3.27 123.51,105.41 v123.51,97.79
N$110
  Top 0.254: IC3.25 121.92,109.22 129.22,109.22 133.35,105.09 SV8.13
N$111  (via drill 0.61)
  Top 0.254: IC3.24 120.02,112.39 119.38,112.39 110.17,103.19 v110.17,92.39 | v109.86,90.49 109.54,90.17 104.14,90.17 SV7.10
  Bottom 0.254: v110.17,92.39 109.86,92.08 v109.86,90.49
PIN_BAT  (via drill 0.61)
  Top 0.254: JP_WIRELESS_CHARGE.1 26.04,54.61 | v67.31,113.67 96.52,113.67 96.52,123.19 95.25,124.46 JP2.3 | v57.78,91.44 54.61,88.27 16.51,88.27 7.62,79.38 7.62,76.2 8.89,76.2 S1.2 | 26.04,54.61 13.34,67.31 9.53,67.31 v6.35,70.48 | JP_BAT_CHARGER_IN+.1 24.13,19.05 26.04,20.95 26.04,54.61
  Bottom 0.254: v67.31,113.67 57.78,104.14 v57.78,91.44 | v6.35,70.48 6.99,71.12 6.99,74.3 8.89,76.2 S1.2
PIN_MOTOR_GND  (via drill 0.61)
  Top 0.254: v9.84,96.52 28.89,115.57 28.89,117.79 31.75,120.65 31.75,139.06 43.81,151.13 58.1,151.13 58.42,150.81 62.55,150.81 69.85,143.51 80.64,143.51 81.28,142.88 91.12,142.88 v92.08,141.92
  Bottom 0.254: Q2.2 9.84,96.2 v9.84,96.52 | JP2.8 92.08,137.16 v92.08,141.92
PIN_MOTOR_VCC  (via drill 0.61)
  Top 0.254: v9.53,94.93 30.48,115.89 30.48,118.11 32.7,120.33 32.7,139.06 44.13,150.5 57.78,150.5 58.42,149.86 58.42,138.43 75.56,138.43 78.11,140.97 93.34,140.97 JP2.9
  Bottom 0.254: v9.53,94.93 Q1.2
PIN_SOUND
  Top 0.254: R1.1 47.31,146.05 47.31,137.79 51.44,133.67 51.44,128.27 93.34,128.27 JP2.4
SCLK  (via drill 0.61)
  Top 0.254: v56.52,115.57 51.75,115.57 46.67,120.65 38.42,120.65 33.02,115.25 CON_SD.5 | v59.37,118.43 59.69,118.11 93.34,118.11 JP2.1
  Bottom 0.254: v59.37,118.43 v56.52,115.57
SDA  (via drill 0.61)
  Top 0.254: 129.54,134.62 IC3.13 | 129.54,134.62 146.05,134.62 IC4.13 | 129.54,134.62 97.47,134.62 94.93,132.08 JP2.6 93.34,133.35 v72.39,133.35 | IC1.13 57.15,134.62 | 57.15,134.62 65.09,134.62 67.31,136.84 R11.1 | 57.15,134.62 57.15,146.69 | 57.15,146.69 CON_RTC.3 | v16.51,62.23 12.06,62.23 10.79,60.96 TEA5767.1 | v33.66,121.92 33.66,139.06 40.01,139.06 45.72,144.78 45.72,147.32 53.34,147.32 53.98,146.69 57.15,146.69
  Bottom 0.254: IC2.13 73.34,112.08 73.34,113.67 68.9,118.11 68.9,123.51 65.72,126.68 | 65.72,126.68 57.78,134.62 IC1.13 | 65.72,126.68 v72.39,133.35 | v16.51,62.23 29.84,75.56 29.84,118.11 v33.66,121.92
SDL  (via drill 0.61)
  Top 0.254: IC4.12 146.05,129.54 129.54,129.54 IC3.12 127,132.08 115.25,132.08 113.98,130.81 73.34,130.81 69.22,134.94 | 69.22,134.94 66.36,132.08 IC1.12 | 69.22,134.94 70.17,135.89 | 70.17,135.89 71.12,136.84 R12.1 | 70.17,135.89 80.64,135.89 81.28,135.25 93.98,135.25 JP2.7 | v8.26,58.42 8.26,60.33 TEA5767.2 | v5.08,62.87 5.08,118.11 6.99,120.02 v25.4,120.02
  Bottom 0.254: IC2.12 92.08,127.64 92.08,132.72 93.98,134.62 JP2.7 | CON_RTC.4 50.8,144.78 50.8,139.06 | 50.8,139.06 50.8,133.99 52.7,132.08 IC1.12 | v8.26,58.42 5.08,61.59 v5.08,62.87 | v25.4,120.02 44.45,139.06 50.8,139.06
VIBRATION_MOTOR  (via drill 0.61)
  Top 0.254: v39.69,101.6 40.64,100.65 52.07,100.65 55.56,104.14 v55.56,113.35 | v62.55,120.33 62.87,120.65 93.34,120.65 JP2.2 | v27.3,53.34 26.67,53.34 26.67,5.08 R2.2 | v27.3,55.88 27.3,62.23 28.57,62.23 32.38,66.04 v32.38,84.14
  Bottom 0.254: v32.38,84.14 31.43,85.09 31.43,93.34 v39.69,101.6 | v62.55,120.33 v55.56,113.35 | v27.3,55.88 v27.3,53.34